# EAGLE schematic laminator (EAGLE 7.4.0)
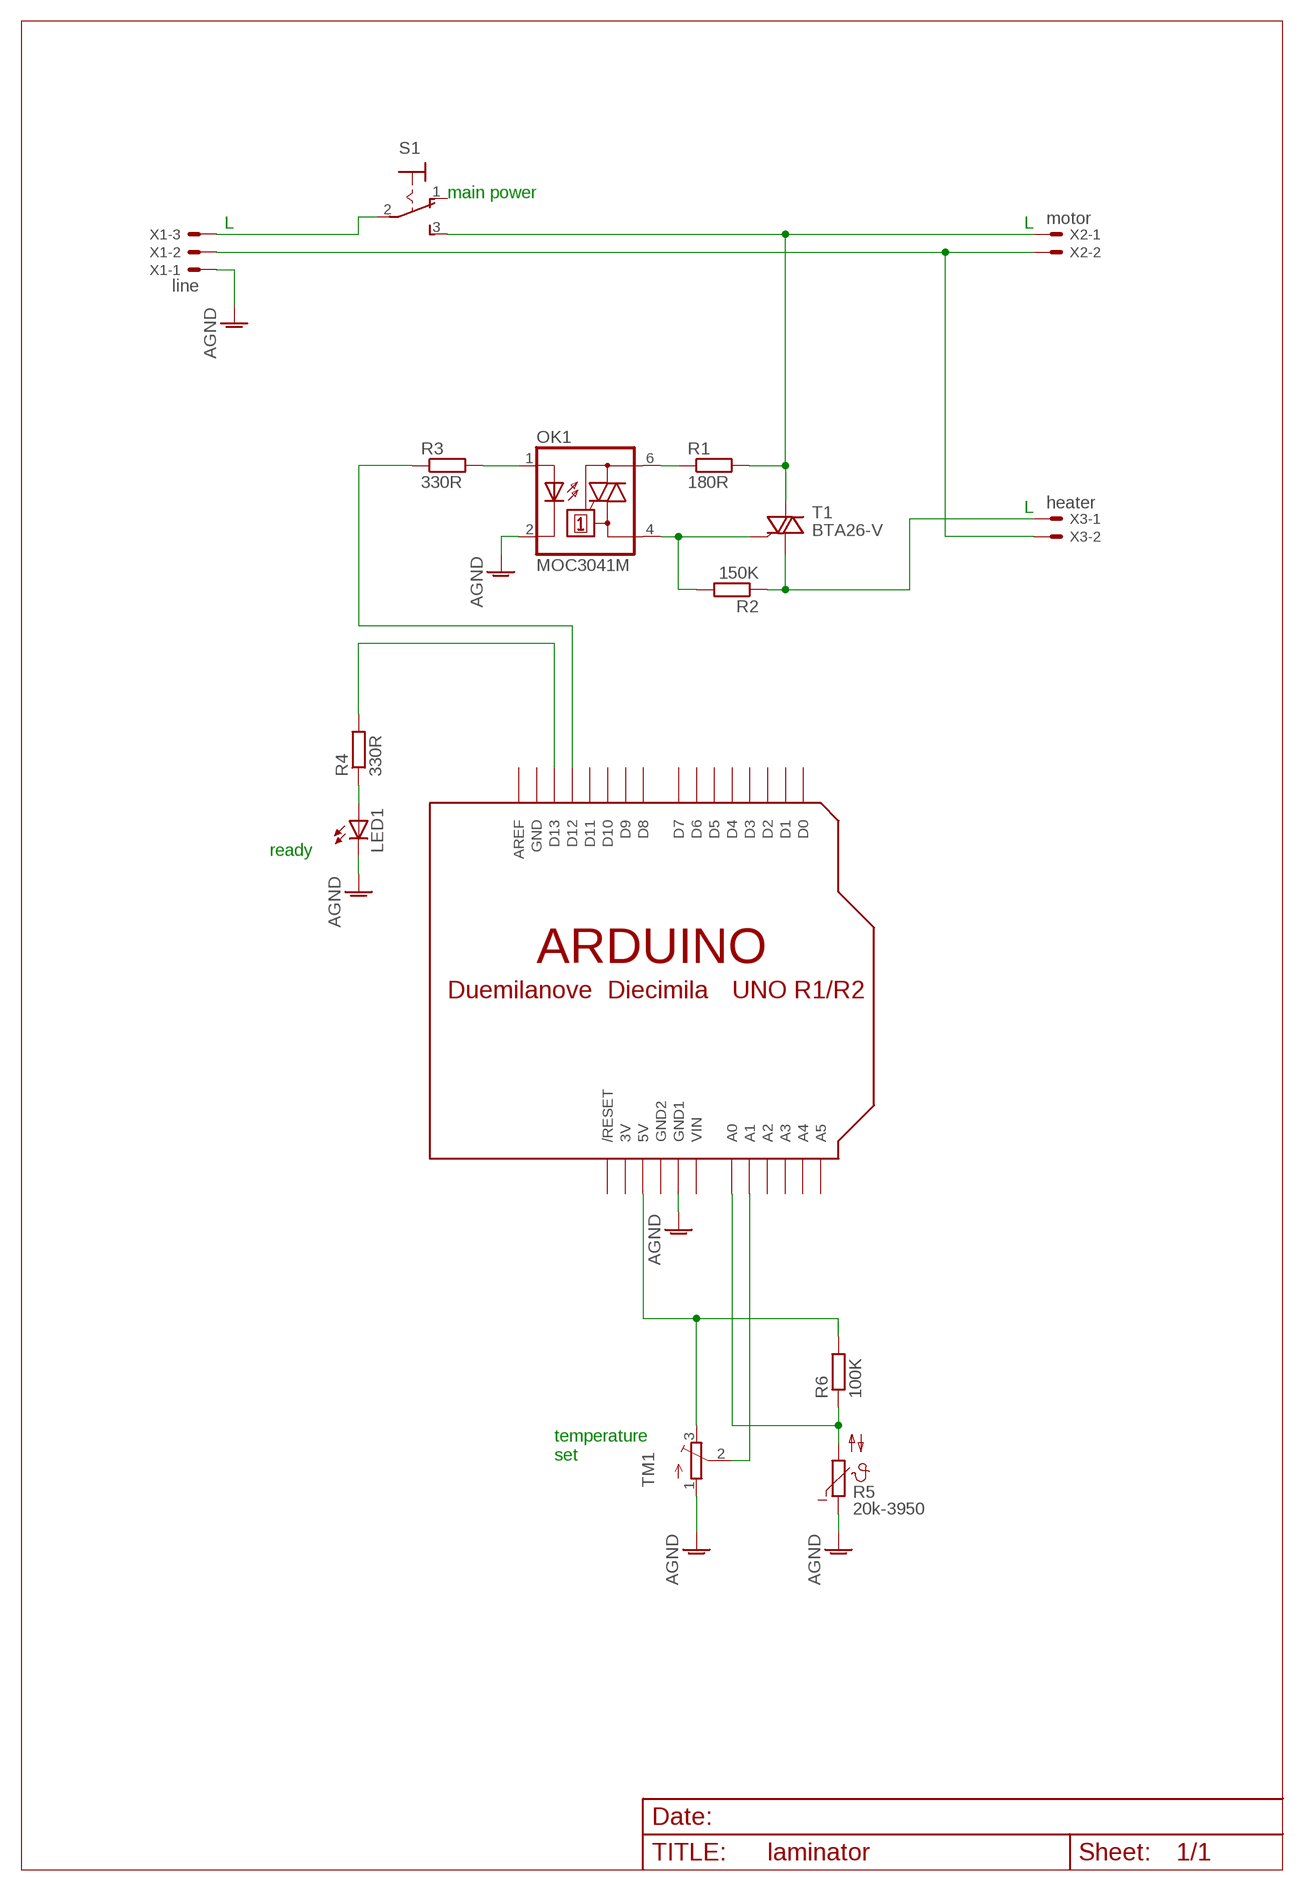
[diagram p0: schematic, sheet 1]

## Parts
LED1  LED5MM  [LED5MM]
OK1  MOC3041M  [DIL06]
R1  180R  R-EU_0207/7  [0207/7]
R2  150K  R-EU_0207/7  [0207/7]
R3  330R  R-EU_0207/7  [0207/7]
R4  330R  R-EU_0207/7  [0207/7]
R5  20k-3950  NTC640  [P640]
R6  100K  R-EU_0207/7  [0207/7]
S1  M9040P  [M9040P]
T1  BTA26-V  [TOP3S-1]
TM1  TRIMPOT3386  [TRIM-3386]
U$1  ARDUINO-BPLACE  [ARDUINO-BPLACE]
X1  line  22-23-2031  [22-23-2031]
X2  motor  22-23-2021  [22-23-2021]
X3  heater  22-23-2021  [22-23-2021]

## Nets
AGND: LED1.K(C) OK1.2(C) R5.1 TM1.1(A) U$1.GND1 X1.1
N$1: OK1.4(A1) R2.2 T1.G
N$2: OK1.6(A2) R1.1
N$3: R1.2 S1.3(S) T1.A2 X2.1
N$4: R2.1 T1.A1 X3.1
N$5: S1.2(P) X1.3
N$7: X1.2 X2.2 X3.2
N$8: TM1.2(S) U$1.A1
N$9: OK1.1(A) R3.2
N$10: R3.1 U$1.D12
N$11: LED1.A R4.1
N$12: R4.2 U$1.D13
N$13: R5.2 R6.1 U$1.A0
N$14: R6.2 TM1.3(E) U$1.5V
Unconnected: S1.1(O) U$1.A2 U$1.A3 U$1.A4 U$1.A5 U$1.AREF U$1.D0 U$1.D1 U$1.D2 U$1.D3 U$1.D4 U$1.D5 U$1.D6 U$1.D7 U$1.D8 U$1.D9 U$1.D10 U$1.D11 U$1.RESET(/RESET)

## Notes on the sheet
- main power
- L | L
- L
- ready
- temperature 
  set

## Power pins joined to a net without a drawn wire
3V: U$1.3V
GND: U$1.GND
GND2: U$1.GND2
VIN: U$1.VIN

## Library data of the parts
LED1 = adafruit:LED: LED OSRAM: - CHIPLED LG R971, LG N971, LY N971, LG Q971, LY Q971, LO R971, LY R971 LH N974, LH R974 LS Q976, LO Q976, LY Q976 LO Q996 - Hyper CHIPLED LW Q18S LB Q993, LB Q99A, LB R99A - SideLED LS A670, LO A670, LY A670, LG A670, LP A670 LB A673, LV A673, LT A673, LW A673 LH A674 LY A675 LS A676, LA A676, LO A676, LY A676, LW A676 LS A679, LY A679, LG A679 - Hyper Micro SIDELED® LS Y876, LA Y876, LO Y876, LY Y876 LT Y87S - SmartLED LW L88C, LW L88S LB L89C, LB L89S, LG L890 LS L89K, LO L89K, LY L89K LS L896, LA L896, LO L896, LY L896 - TOPLED LS T670, LO T670, LY T670, LG T670, LP T670 LSG T670, LSP T670, LSY T670, LOP T670, LYG T670 LG T671, LOG T671, LSG T671 LB T673, LV T673, LT T673, LW T673 LH T674 LS T676, LA T676, LO T676, LY T676, LB T676, LH T676, LSB T676, LW T676 LB T67C, LV T67C, LT T67C, LS T67K, LO T67K, LY T67K, LW E67C LS E67B, LA E67B, LO E67B, LY E67B, LB E67C, LV E67C, LT E67C LW T67C LS T679, LY T679, LG T679 LS T770, LO T770, LY T770, LG T770, LP T770 LB T773, LV T773, LT T773, LW T773 LH T774 LS E675, LA E675, LY E675, LS T675 LS T776, LA T776, LO T776, LY T776, LB T776 LHGB T686 LT T68C, LB T68C - Hyper Mini TOPLED® LB M676 - Mini TOPLED Santana® LG M470 LS M47K, LO M47K, LY M47K Source: http://www.osram.convergy.de/
OK1 = optocoupler:MOC30*: 6-Pin DIP Zero-Cross Optoisolators Triac Driver Output (250/400 Volt Peak) Source: Data sheet <http://www.fairchildsemi.com/ds/MO/MOC3031M.pdf> The old path of data sheet not more available 2013-05-06.; MF: FAIRCHILD SEMICONDUCTOR; MPN: MOC3041M; OC_FARNELL: 1086677; OC_NEWARK: 78K6090
R1-R4 R6 = rcl:R-EU_: RESISTOR, European symbol
R5 = ptc-ntc:NTC640: PHILIPS NTC; OC_FARNELL: unknown; OC_NEWARK: unknown
S1 = switch:M9040P: TOGGLE SWITCH Marquardt
T1 = triac:BTA26: 25A TRIAC Source: http://www.st.com/stonline/products/literature/ds/7470.pdf
TM1 = adafruit:TRIMPOT: SMT trimmer potentiometer part number TC33X http://www.ladyada.net/library/eagle
U$1 = adafruit:ARDUINO: Arduino Diecimila/Duemilanove Make a shield with ease, this package has all the named pins as well as the two mounting drill holes and an outline of the USB and DC power connector. The outline is on the DIMENSION layer, so if your board house uses it they will cut the outline to match. http://www.ladyada.net/library/pcb/eaglelibrary.html
X1 = con-molex:22-23-2031: .100" (2.54mm) Center Header - 3 Pin; MF: MOLEX; MPN: 22-23-2031; OC_FARNELL: 1462950; OC_NEWARK: 30C0862
X2 X3 = con-molex:22-23-2021: .100" (2.54mm) Center Header - 2 Pin; MF: MOLEX; MPN: 22-23-2021; OC_FARNELL: 1462926; OC_NEWARK: 25C3832